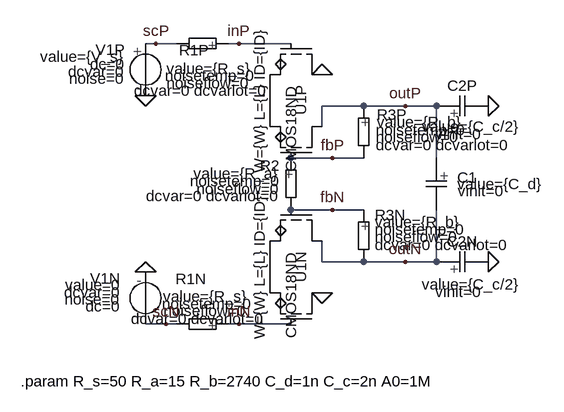
[diagram p0: schematic balancedMOSAmp.asc]
balancedMOSAmp.asc, the LTspice schematic file:
Version 4
SHEET 1 880 680
WIRE -48 -80 -64 -80
WIRE -16 -80 -48 -80
WIRE 80 -80 64 -80
WIRE 160 -80 80 -80
WIRE 272 16 208 16
WIRE 336 16 272 16
WIRE 384 16 336 16
WIRE 208 48 208 16
WIRE 224 96 160 96
WIRE 272 96 224 96
WIRE 384 96 384 16
WIRE 224 176 160 176
WIRE 272 176 224 176
WIRE 208 256 208 224
WIRE 272 256 208 256
WIRE 336 256 272 256
WIRE 384 256 384 176
WIRE 384 256 336 256
WIRE -32 352 -64 352
WIRE -16 352 -32 352
WIRE 80 352 64 352
WIRE 160 352 80 352
FLAG 208 -32 0
FLAG 208 304 0
FLAG 464 16 0
FLAG 464 256 0
FLAG -64 0 0
FLAG -64 272 0
FLAG 336 16 outP
FLAG 336 256 outN
FLAG 80 -80 inP
FLAG 80 352 inN
FLAG 224 96 fbP
FLAG 224 176 fbN
FLAG -48 -80 scP
FLAG -32 352 scN
SYMBOL SLR 160 96 M0
WINDOW 0 17 12 Left 2
WINDOW 123 16 36 Left 2
WINDOW 39 17 48 Left 2
WINDOW 40 17 59 Left 2
SYMATTR InstName R2
SYMATTR Value value={R_a}
SYMBOL SLR 272 16 R0
WINDOW 0 20 13 Left 2
WINDOW 3 20 25 Left 2
WINDOW 123 19 37 Left 2
WINDOW 39 19 48 Left 2
WINDOW 40 19 60 Left 2
SYMATTR InstName R3P
SYMATTR Value value={R_b}
SYMBOL SLR 272 176 R0
WINDOW 0 17 8 Left 2
WINDOW 3 17 19 Left 2
WINDOW 123 17 30 Left 2
WINDOW 39 17 42 Left 2
WINDOW 40 17 54 Left 2
SYMATTR InstName R3N
SYMATTR Value value={R_b}
SYMBOL SLC 384 96 R0
WINDOW 0 32 30 Left 2
WINDOW 123 33 51 Left 2
SYMATTR InstName C1
SYMATTR Value value={C_d}
SYMBOL SLC 384 16 M90
WINDOW 0 -16 40 VBottom 2
WINDOW 3 16 53 VTop 2
WINDOW 123 28 34 VTop 2
SYMATTR InstName C2P
SYMATTR Value value={C_c/2}
SYMBOL SLC 384 256 M90
WINDOW 0 -16 40 VBottom 2
WINDOW 3 19 53 VTop 2
WINDOW 123 31 34 VTop 2
SYMATTR InstName C2N
SYMATTR Value value={C_c/2}
SYMBOL SLV -64 -80 M0
WINDOW 3 32 20 Left 2
WINDOW 123 32 32 Left 2
WINDOW 39 32 43 Left 2
WINDOW 40 32 54 Left 2
SYMATTR Value value={V_s}
SYMATTR InstName V1P
SYMBOL SLV -64 352 R180
WINDOW 123 39 27 Left 2
WINDOW 39 38 49 Left 2
WINDOW 40 39 38 Left 2
WINDOW 0 39 70 Left 2
WINDOW 3 38 60 Left 2
SYMATTR InstName V1N
SYMBOL SLR 64 -80 R90
WINDOW 0 26 53 VBottom 2
WINDOW 3 23 30 VTop 2
WINDOW 123 34 28 VTop 2
WINDOW 39 45 31 VTop 2
WINDOW 40 57 42 VTop 2
SYMATTR InstName R1P
SYMATTR Value value={R_s}
SYMBOL SLR 64 352 R90
WINDOW 0 -54 58 VBottom 2
WINDOW 3 -58 35 VTop 2
WINDOW 123 -47 33 VTop 2
WINDOW 39 -36 36 VTop 2
WINDOW 40 -24 47 VTop 2
SYMATTR InstName R1N
SYMATTR Value value={R_s}
SYMBOL SLXMD 160 176 R90
SYMATTR InstName U1N
SYMATTR SpiceModel CMOS18ND
SYMBOL SLXMD 160 -80 R90
SYMATTR InstName U1P
SYMATTR SpiceModel CMOS18ND
TEXT -256 440 Left 2 !.param R_s=50 R_a=15 R_b=2740 C_d=1n C_c=2n A0=1M

The netlist it stands for:
* balancedMOSAmp.asc
R2 fbP fbN R value={R_a} noisetemp=0 noiseflow=0 dcvar=0 dcvarlot=0
R3P outP fbP R value={R_b} noisetemp=0 noiseflow=0 dcvar=0 dcvarlot=0
R3N fbN outN R value={R_b} noisetemp=0 noiseflow=0 dcvar=0 dcvarlot=0
C1 outP outN C value={C_d} vinit=0
C2P outP 0 C value={C_c/2} vinit=0
C2N outN 0 C value={C_c/2} vinit=0
V1P scP 0 V value={V_s} dc=0 dcvar=0 noise=0
V1N scN 0 V value=0 dc=0 dcvar=0 noise=0
R1P inP scP R value={R_s} noisetemp=0 noiseflow=0 dcvar=0 dcvarlot=0
R1N inN scN R value={R_s} noisetemp=0 noiseflow=0 dcvar=0 dcvarlot=0
XU1N outN 0 fbN inN CMOS18ND W={W} L={L} ID={ID}  ; pins D1 D2 G1 G2
XU1P 0 outP inP fbP CMOS18ND W={W} L={L} ID={ID}  ; pins D1 D2 G1 G2
.param R_s=50 R_a=15 R_b=2740 C_d=1n C_c=2n A0=1M
.backanno
.end